# Altium schematic sheet RTC.SchDoc
size A
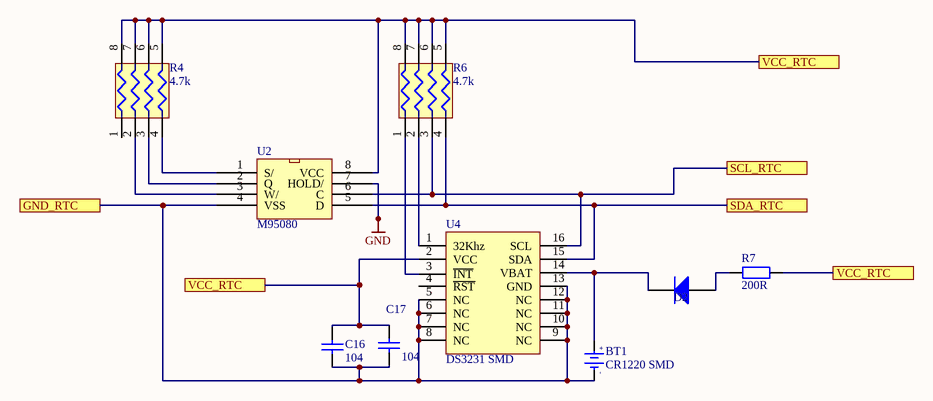
[diagram p0: RTC.SchDoc]

## Parts
BT1  CR1220 SMD  [DE PIN CR1220]
C16  104  [tu 0805]
C17  104  [tu 0805]
D2  SS34  [DIODE SMA]  (value not drawn)
R4  4.7k  [tro bang 0603 4]
R6  4.7k  [tro bang 0603 4]
R7  200R  [tro smd 0805]
U2  M95080  [SOP8_L]
U4  DS3231 SMD  [SOIC 16]

## Ports
GND_RTC, SCL_RTC, SDA_RTC, VCC_RTC

## Nets
GND: U2.7(HOLD/)
GND_RTC: BT1.2(GND) C16.2 C17.2 U2.4(VSS) U4.5(NC) U4.6(NC) U4.7(NC) U4.8(NC) U4.9(NC) U4.10(NC) U4.11(NC) U4.12(NC) U4.13(GND) ; port GND_RTC
SCL_RTC: R6.3 U2.6(C) U4.16(SCL) ; port SCL_RTC
SDA_RTC: R6.4 U2.5(D) U4.15(SDA) ; port SDA_RTC
VCC_RTC: C16.1 C17.1 R4.5 R4.6 R4.7 R4.8 R6.5 R6.6 R6.7 R6.8 R7.2 U2.8(VCC) U4.2(VCC) ; port VCC_RTC
NetBT1_1: BT1.1(+3V) D2.2(K) U4.14(VBAT)
NetD2_1: D2.1(A) R7.1
NetR4_2: R4.2 U2.3(W/)
NetR4_3: R4.3 U2.2(Q)
NetR4_4: R4.4 U2.1(S/)
NetR6_1: R6.1 U4.3(~{INT})
NetR6_2: R6.2 U4.1(32Khz)

Not connected (* = marked no-connect by the designer): R4 1; U4 4(~{RST})

## Notes on the sheet
- (in symbol De pin CR1220 SMD) +; -

## Library data of the parts
BT1 = De pin CR1220 SMD: Ten: Đế PIN CR1220 SMD; Ma_Hang: MH000833
C16 C17 = Tu 0805 104 50V 10%: Dán; Don_Vi: Con; So_Chan: 2; Ten_Linh_Kien: Tụ 0805 104-100nF 10% 50V; Ma_Hang: MH004551; Chung_Loai: Dán; Kieu_Chan: *
D2 = Diode SS34 ( 1N5822 ): Dán; Don_Vi: Con; Ma_Hang: MH002104; Ten_Linh_Kien: Diode SS34 3A 40V SMA ( 1N5822 SS34A); Kieu_Chan: *; Chung_Loai: Dán
R4 R6 = Tro bang 0603 4.7k: Dán; Don_Vi: Con; So_Chan: 8; Ten_Linh_Kien: Trở băng 0603x4 4.7k; Ma_Hang: MH001448; Chung_Loai: Dán; Kieu_Chan: *
R7 = Tro 0805 5% 220R: Dán; Don_Vi: Con; So_Chan: 2; Ten_Linh_Kien: Trở 0805 5% 220R; Ma_Hang: MH005259; Chung_Loai: Dán; Kieu_Chan: *
U2 = EEPROM_M95080
U4 = DS3231 SMD: SOIC